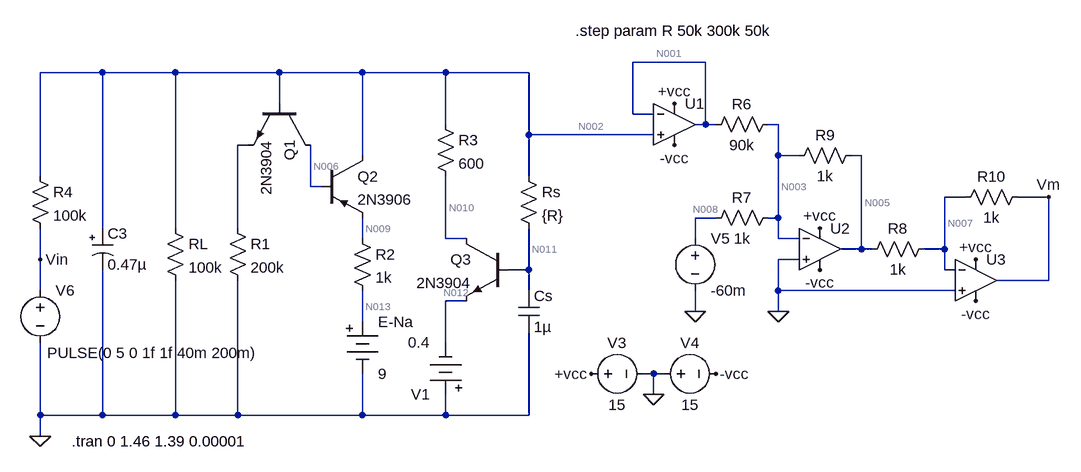
[diagram p0: schematic Rs.asc]
Rs.asc, the LTspice schematic file:
Version 4
SHEET 1 2272 680
WIRE 880 -208 768 -208
WIRE -48 -192 -144 -192
WIRE 64 -192 -48 -192
WIRE 224 -192 64 -192
WIRE 352 -192 224 -192
WIRE 480 -192 352 -192
WIRE 608 -192 480 -192
WIRE 224 -144 224 -192
WIRE 768 -128 768 -208
WIRE 800 -128 768 -128
WIRE 480 -112 480 -192
WIRE 880 -112 880 -208
WIRE 880 -112 864 -112
WIRE 896 -112 880 -112
WIRE 992 -112 976 -112
WIRE 608 -96 608 -192
WIRE 800 -96 608 -96
WIRE 176 -80 160 -80
WIRE 352 -64 352 -192
WIRE 992 -64 992 -112
WIRE 1024 -64 992 -64
WIRE 1120 -64 1104 -64
WIRE -144 -32 -144 -192
WIRE 608 -32 608 -96
WIRE 272 -16 272 -80
WIRE 288 -16 272 -16
WIRE 1280 0 1248 0
WIRE 1408 0 1360 0
WIRE 896 32 864 32
WIRE 992 32 992 -64
WIRE 992 32 976 32
WIRE -48 48 -48 -192
WIRE 64 48 64 -192
WIRE 160 48 160 -80
WIRE 352 64 352 32
WIRE 480 64 480 -32
WIRE 512 64 480 64
WIRE 864 64 864 32
WIRE 992 64 992 32
WIRE 1024 64 992 64
WIRE 1120 80 1120 -64
WIRE 1120 80 1088 80
WIRE 1136 80 1120 80
WIRE 1248 80 1248 0
WIRE 1248 80 1216 80
WIRE -144 96 -144 48
WIRE 1024 96 992 96
WIRE 608 112 608 48
WIRE 608 112 576 112
WIRE 1248 112 1248 80
WIRE 1264 112 1248 112
WIRE 1408 128 1408 0
WIRE 1408 128 1328 128
WIRE -144 144 -144 96
WIRE 608 144 608 112
WIRE 992 144 992 96
WIRE 1264 144 992 144
WIRE 512 160 480 160
WIRE 864 176 864 144
WIRE 992 176 992 144
WIRE 352 192 352 144
WIRE 480 224 480 160
WIRE 800 272 784 272
WIRE 816 272 800 272
WIRE 800 304 800 272
WIRE -144 336 -144 224
WIRE -48 336 -48 112
WIRE -48 336 -144 336
WIRE 64 336 64 128
WIRE 64 336 -48 336
WIRE 160 336 160 128
WIRE 160 336 64 336
WIRE 352 336 352 272
WIRE 352 336 160 336
WIRE 480 336 480 304
WIRE 480 336 352 336
WIRE 608 336 608 208
WIRE 608 336 480 336
WIRE -144 368 -144 336
FLAG -144 368 0
FLAG 800 304 0
FLAG 704 272 +vcc
FLAG 896 272 -vcc
FLAG 832 -144 +vcc
FLAG 832 -80 -vcc
FLAG 992 176 0
FLAG 864 176 0
FLAG 1056 112 -vcc
FLAG 1056 48 +vcc
FLAG 1296 160 -vcc
FLAG 1296 96 +vcc
FLAG 1408 0 Vm
FLAG -144 96 Vin
SYMBOL res 48 32 R0
SYMATTR InstName RL
SYMATTR Value 100k
SYMBOL res 144 32 R0
SYMATTR InstName R1
SYMATTR Value 200k
SYMBOL res 336 48 R0
SYMATTR InstName R2
SYMATTR Value 1k
SYMBOL res 592 -48 R0
SYMATTR InstName Rs
SYMATTR Value {R}
SYMBOL cap 592 144 R0
SYMATTR InstName Cs
SYMATTR Value 1µ
SYMBOL npn 272 -144 R90
SYMATTR InstName Q1
SYMATTR Value 2N3904
SYMBOL pnp 288 -64 R0
SYMATTR InstName Q2
SYMATTR Value 2N3906
SYMBOL Misc\\battery 352 176 R0
WINDOW 123 0 0 Left 0
WINDOW 39 0 0 Left 0
SYMATTR InstName E-Na
SYMATTR Value 9
SYMBOL npn 576 64 M0
SYMATTR InstName Q3
SYMATTR Value 2N3904
SYMBOL OpAmps\\UniversalOpAmp 832 -112 R0
SYMATTR InstName U1
SYMBOL OpAmps\\UniversalOpAmp 1056 80 R0
SYMATTR InstName U2
SYMBOL OpAmps\\UniversalOpAmp 1296 128 R0
SYMATTR InstName U3
SYMBOL res 992 -128 R90
WINDOW 0 0 56 VBottom 2
WINDOW 3 32 56 VTop 2
SYMATTR InstName R6
SYMATTR Value 90k
SYMBOL res 992 16 R90
WINDOW 0 0 56 VBottom 2
WINDOW 3 32 56 VTop 2
SYMATTR InstName R7
SYMATTR Value 1k
SYMBOL res 1232 64 R90
WINDOW 0 0 56 VBottom 2
WINDOW 3 32 56 VTop 2
SYMATTR InstName R8
SYMATTR Value 1k
SYMBOL res 1120 -80 R90
WINDOW 0 0 56 VBottom 2
WINDOW 3 32 56 VTop 2
SYMATTR InstName R9
SYMATTR Value 1k
SYMBOL voltage 688 272 R270
WINDOW 0 32 56 VTop 2
WINDOW 3 -32 56 VBottom 2
WINDOW 123 0 0 Left 0
WINDOW 39 0 0 Left 0
SYMATTR InstName V3
SYMATTR Value 15
SYMBOL voltage 800 272 R270
WINDOW 0 32 56 VTop 2
WINDOW 3 -32 56 VBottom 2
WINDOW 123 0 0 Left 0
WINDOW 39 0 0 Left 0
SYMATTR InstName V4
SYMATTR Value 15
SYMBOL res 1376 -16 R90
WINDOW 0 0 56 VBottom 2
WINDOW 3 32 56 VTop 2
SYMATTR InstName R10
SYMATTR Value 1k
SYMBOL voltage 864 48 R0
WINDOW 123 0 0 Left 0
WINDOW 39 0 0 Left 0
SYMATTR InstName V5
SYMATTR Value -60m
SYMBOL polcap -64 48 R0
SYMATTR InstName C3
SYMATTR Value 0.47µ
SYMBOL voltage -144 128 R0
WINDOW 123 0 0 Left 0
WINDOW 39 0 0 Left 0
WINDOW 3 11 112 Left 2
SYMATTR Value PULSE(0 5 0 1f 1f 40m 200m)
SYMATTR InstName V6
SYMBOL res -160 -48 R0
SYMATTR InstName R4
SYMATTR Value 100k
SYMBOL res 464 -128 R0
SYMATTR InstName R3
SYMATTR Value 600
SYMBOL Misc\\battery 480 320 R180
WINDOW 123 0 0 Left 0
WINDOW 39 0 0 Left 0
SYMATTR InstName V1
SYMATTR Value 0.4
TEXT -96 376 Left 2 !.tran 0 1.46 1.39 0.00001
TEXT 680 -256 Left 2 !.step param R 50k 300k 50k

The netlist it stands for:
* Rs.asc
RL N002 0 100k
R1 N004 0 200k
R2 N009 N013 1k
Rs N002 N011 {R}
Cs N011 0 1µ
Q1 N006 N002 N004 0 2N3904
Q2 N002 N006 N009 0 2N3906
V§E-Na N013 0 9
Q3 N010 N011 N012 0 2N3904
XU1 N002 N001 +vcc -vcc N001 level1 Avol=1Meg GBW=10Meg Vos=0 En=0 Enk=0 In=0 Ink=0 Rin=500Meg  ; pins In+ In- V+ V- OUT
XU2 0 N003 +vcc -vcc N005 level1 Avol=1Meg GBW=10Meg Vos=0 En=0 Enk=0 In=0 Ink=0 Rin=500Meg  ; pins In+ In- V+ V- OUT
XU3 0 N007 +vcc -vcc Vm level1 Avol=1Meg GBW=10Meg Vos=0 En=0 Enk=0 In=0 Ink=0 Rin=500Meg  ; pins In+ In- V+ V- OUT
R6 N003 N001 90k
R7 N003 N008 1k
R8 N007 N005 1k
R9 N005 N003 1k
V3 +vcc 0 15
V4 0 -vcc 15
R10 Vm N007 1k
V5 N008 0 -60m
C3 N002 0 0.47µ
V6 Vin 0 PULSE(0 5 0 1f 1f 40m 200m)
R4 N002 Vin 100k
R3 N002 N010 600
V1 0 N012 0.4
.model NPN NPN
.model PNP PNP
.lib standard.bjt
.tran 0 1.46 1.39 0.00001
.step param R 50k 300k 50k
.lib UniversalOpAmp1.lib
.backanno
.end

* Results of the author's LTspice run, read from the files saved beside the schematic
* Operating Point (first step), zero values left out:
*   r = 50 k
*   V(n002) = -2.21 mV
*   V(n009) = 9 V
*   V(n013) = 9 V
*   V(n011) = -2.218 mV
*   V(n006) = 8.67 V
*   V(n010) = -2.239 mV
*   V(n012) = -400 mV
*   V(n001) = -2.21 mV
*   V(+vcc) = 15 V
*   V(-vcc) = -15 V
*   V(n003) = -60.04 nV
*   V(n005) = 60.02 mV
*   V(n007) = 60.03 nV
*   V(vm) = -60.02 mV
*   V(n008) = -60 mV
*   Ic(Q2) = -3.711 nA
*   Ib(Q2) = -8.69 pA
*   Ie(Q2) = 3.72 nA
*   Ic(Q3) = 47.76 nA
*   Ib(Q3) = 159.6 pA
*   Ie(Q3) = -47.92 nA
*   Ic(Q1) = 8.686 pA
*   Ib(Q1) = -8.676 pA
*   I(R3) = 47.76 nA
*   I(R4) = -22.1 nA
*   I(R10) = -60.02 µA
*   I(R9) = 60.02 µA
*   I(R8) = -60.02 µA
*   I(R7) = 60 µA
*   I(R6) = 24.55 nA
*   I(Rs) = 159.6 pA
*   I(R2) = -3.72 nA
*   I(Rl) = -22.1 nA
*   I(V1) = -47.92 nA
*   I(V6) = -22.1 nA
*   I(V5) = 60 µA
*   I(V4) = -90 nA
*   I(V3) = -90 nA
*   I(E-na) = -3.72 nA
*   Ix(u1:1) = -4.42 pA
*   Ix(u1:2) = -4.42 pA
*   Ix(u1:3) = 30 nA
*   Ix(u1:4) = -30 nA
*   Ix(u1:5) = 23.89 nA
*   Ix(u2:3) = 30 nA
*   Ix(u2:4) = -30 nA
*   Ix(u2:5) = -120.1 µA
*   Ix(u3:3) = 30 nA
*   Ix(u3:4) = -30 nA
*   Ix(u3:5) = 60.02 µA
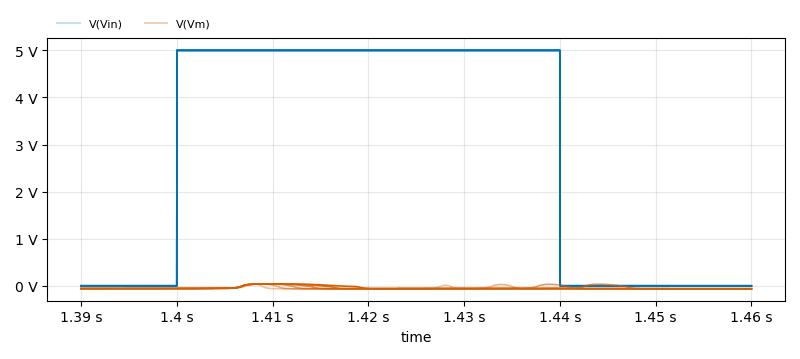
[diagram p1: Transient Analysis of Rs.asc, plotted from the saved traces]
* Transient Analysis, 6 runs:
*   V(Vin) [r=50000]: min 0 V, max 5 V, average 2.857 V, rms 3.78 V, last 0 V
*   V(Vin) [r=100000]: min 0 V, max 5 V, average 2.857 V, rms 3.78 V, last 0 V
*   V(Vin) [r=150000]: min 0 V, max 5 V, average 2.857 V, rms 3.78 V, last 0 V
*   V(Vin) [r=200000]: min 0 V, max 5 V, average 2.857 V, rms 3.78 V, last 0 V
*   V(Vin) [r=250000]: min 0 V, max 5 V, average 2.857 V, rms 3.78 V, last 0 V
*   V(Vin) [r=300000]: min 0 V, max 5 V, average 2.857 V, rms 3.78 V, last 0 V
*   V(Vm) [r=50000]: min -63.69 mV, max 29.66 mV, average -55.62 mV, rms 57.67 mV, last -60.48 mV
*   V(Vm) [r=100000]: min -64.06 mV, max 35.43 mV, average -53 mV, rms 57.78 mV, last -62.06 mV
*   V(Vm) [r=150000]: min -64.25 mV, max 36.53 mV, average -49.4 mV, rms 56.67 mV, last -63.11 mV
*   V(Vm) [r=200000]: min -64.26 mV, max 36.94 mV, average -45.54 mV, rms 55.18 mV, last -63.88 mV
*   V(Vm) [r=250000]: min -63.92 mV, max 37.15 mV, average -48.75 mV, rms 56.93 mV, last -63.85 mV
*   V(Vm) [r=300000]: min -63.99 mV, max 37.28 mV, average -46.27 mV, rms 56.28 mV, last -63.86 mV